# EasyEDA Pro project ProPrj_Y车Y形板_2025-09-30.epro, schematic DCDC
Board Name: TPS54540DCDC插座; Create Date: 2025-05-23; Page Name: P1; Project Name: Y车Y形板; Schematic Name: Schematic1; Update Date: 2025-05-23; Company: 嘉立创EDA; Page Size: A4; Version: V1.0
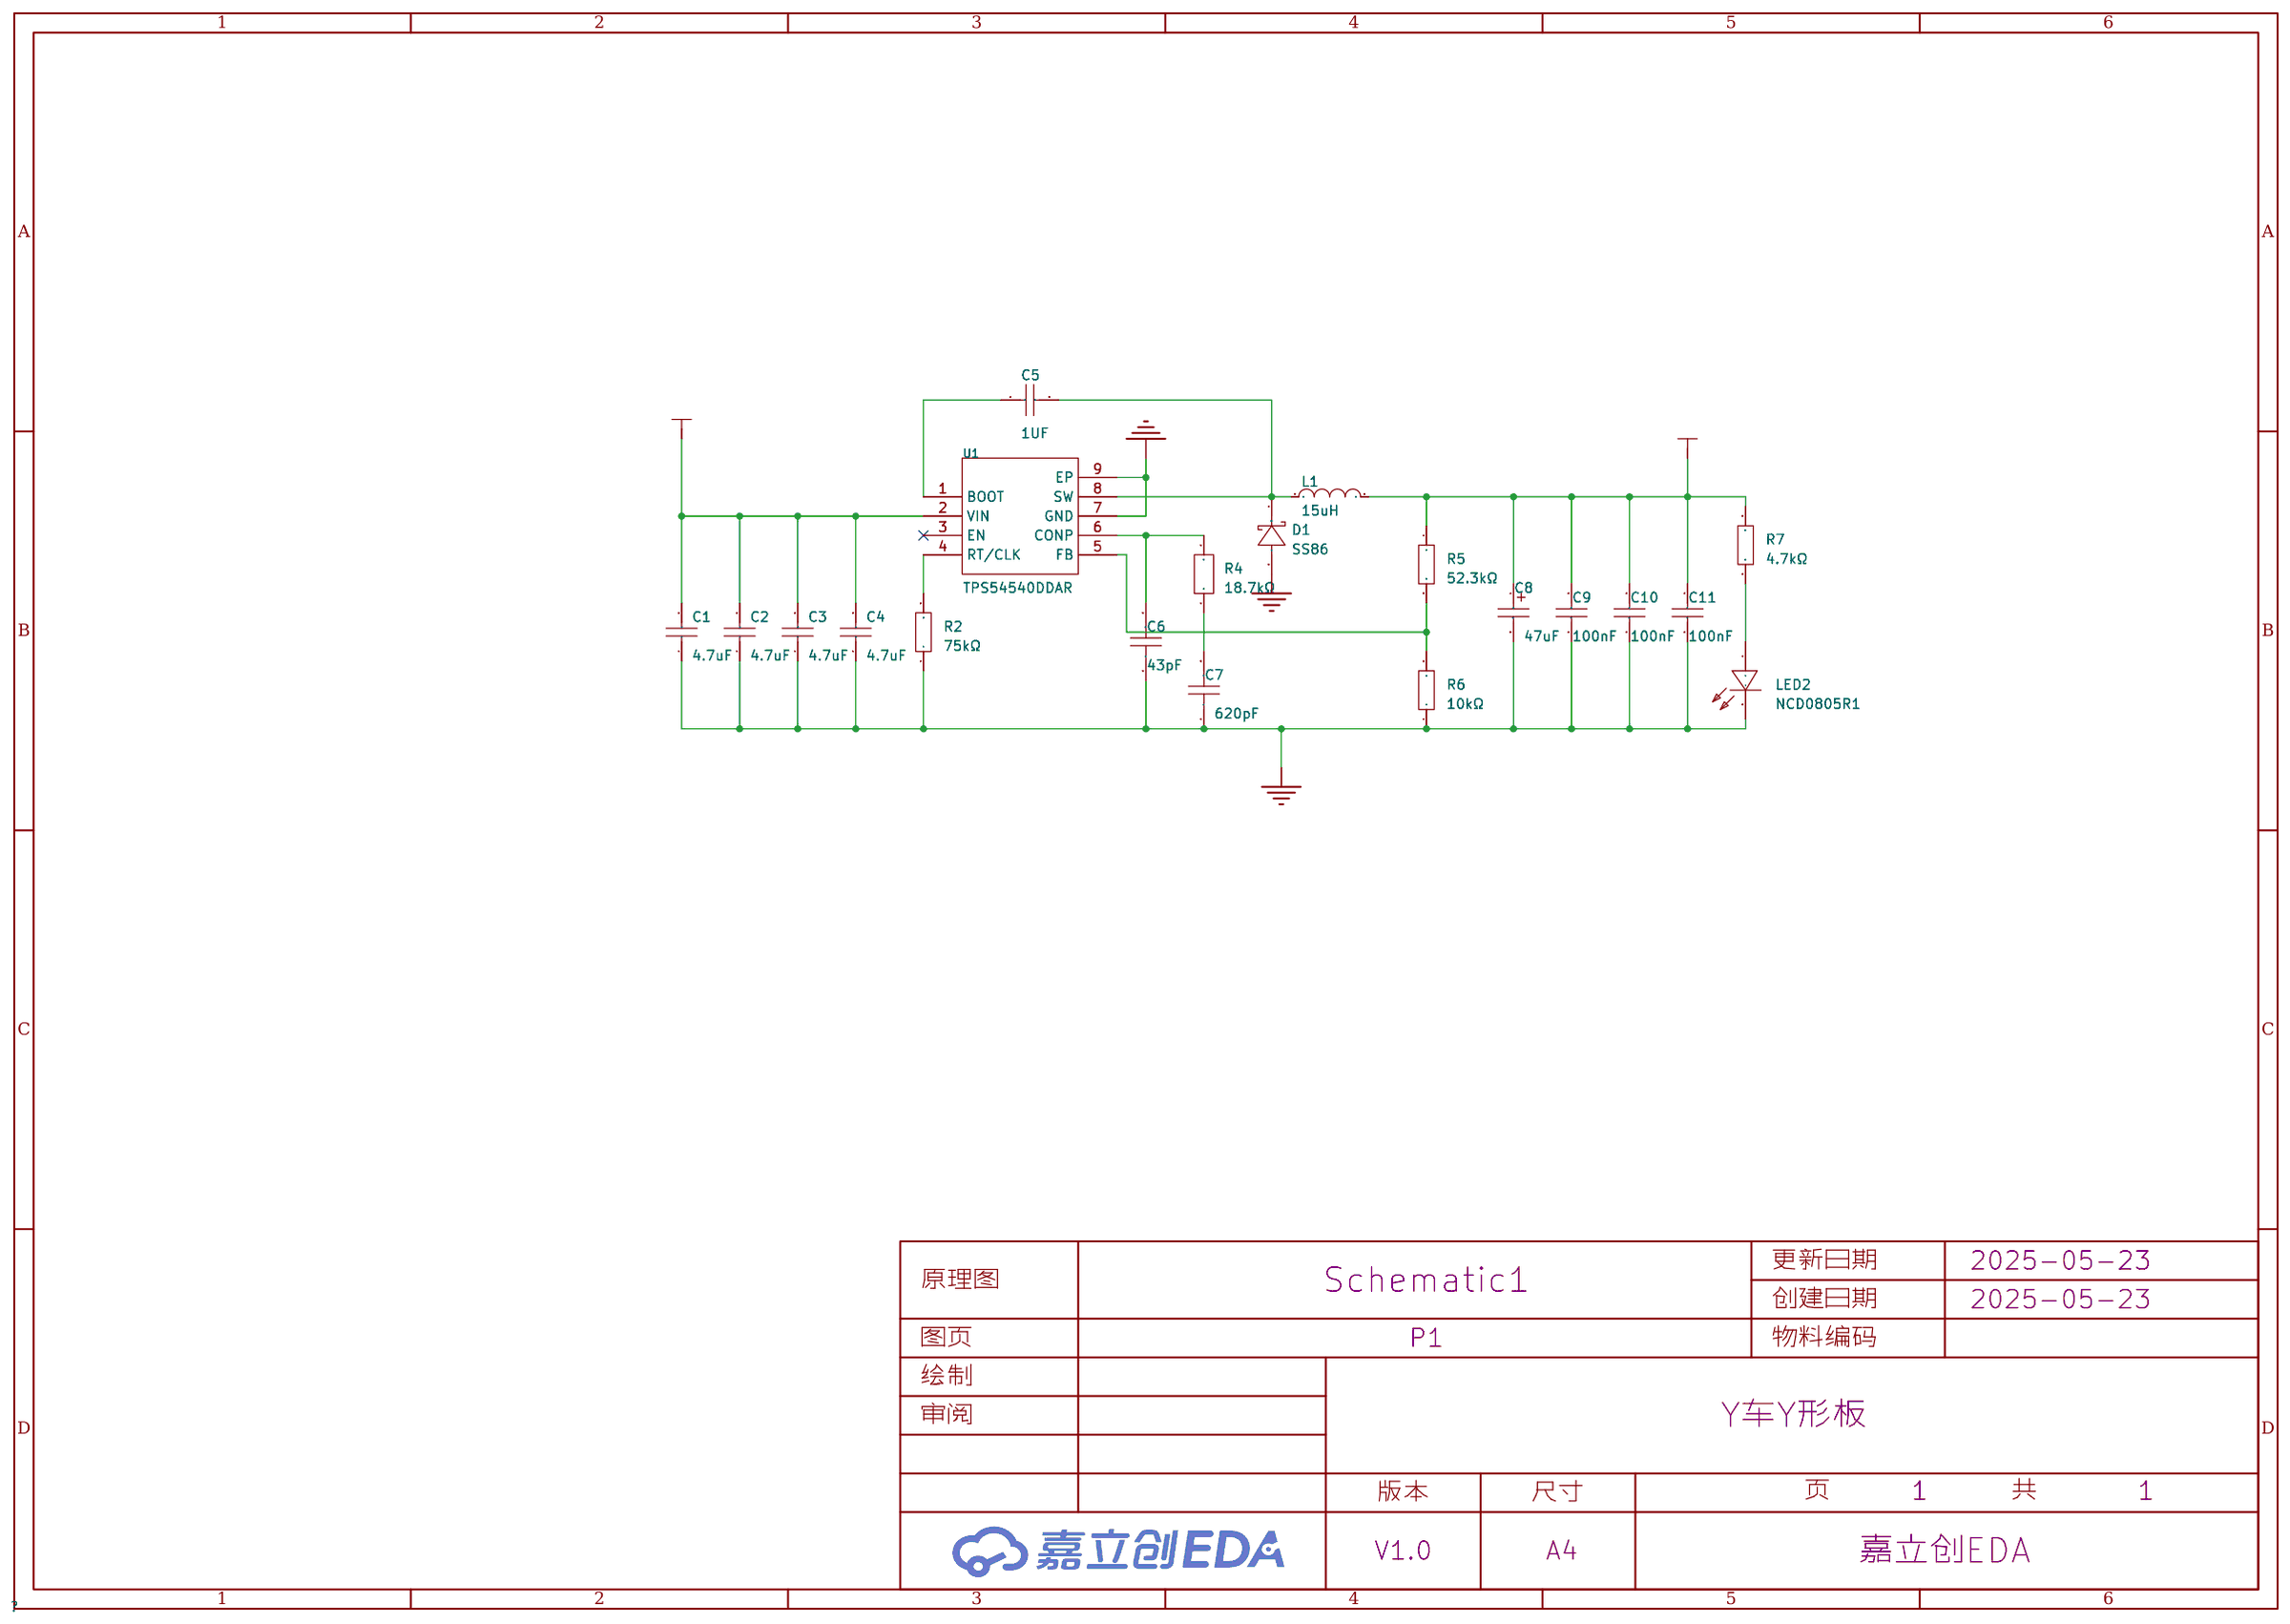
[diagram p1: schematic sheet]

## Parts
C1  4.7uF  [C0805]
C2  4.7uF  [C0805]
C3  4.7uF  [C0805]
C4  4.7uF  [C0805]
C5  1UF  [C0805]
C6  43pF  [C0805]
C7  620pF  [C0805]
C8  47uF  [CAP-SMD_L3.5-W2.8-R-RD]
C9  100nF  [C0805]
C10  100nF  [C0805]
C11  100nF  [C0805]
D1  SS86  [SMC_L6.9-W5.9-LS7.9-RD]
L1  15uH  [IND-SMD_L7.1-W6.6]
LED2  NCD0805R1  [LED0805-R-RD]
R2  75kΩ  [R0805]
R4  18.7kΩ  [R0805]
R5  52.3kΩ  [R0805]
R6  10kΩ  [R0805]
R7  4.7kΩ  [R0805]
U1  TPS54540DDAR  [SOIC-8_L4.9-W3.9-P1.27-LS6.0-BL-EP]

## Library data of the parts
C1-C4 = CL21A475KAQNNNE: 容值:4.7uF;精度:±10%;额定电压:25V;材质(温度系数):X5R;; LCSC Part Name: 4.7uF ±10% 25V; Supplier Part: C1779; Manufacturer: SAMSUNG(三星); Supplier Footprint: 0805; JLCPCB Part Class: 基础库; Datasheet: https://atta.szlcsc.com/upload/public/pdf/source/20160218/1457707763339.pdf; Supplier: LCSC; Tolerance: ±10%; Voltage Rated: 25V; Temperature Coefficient: X5R
C5 = CC0805KRX7R9BB104: 容值:100nF;精度:±10%;额定电压:50V;材质(温度系数):X7R;; LCSC Part Name: 100nF ±10% 50V; Supplier Part: C49678; Manufacturer: YAGEO(国巨); Supplier Footprint: 0805; JLCPCB Part Class: 基础库; Datasheet: https://atta.szlcsc.com/upload/public/pdf/source/20180224/C181747_15194369449651363981.pdf; Supplier: LCSC; Tolerance: ±10%; Voltage Rated: 50V; Temperature Coefficient: X7R
C6 = 0805CG430J500NT: 容值:43pF;精度:±5%;额定电压:50V;材质(温度系数):C0G;; LCSC Part Name: 43pF ±5% 50V; Supplier Part: C502147; Manufacturer: FH(风华); Supplier Footprint: 0805; JLCPCB Part Class: 扩展库; Datasheet: https://atta.szlcsc.com/upload/public/pdf/source/20200305/C486355_26A10D38EF8C2A5C37091D0039909270.pdf; Supplier: LCSC; Tolerance: ±5%; Voltage Rated: 50V; Temperature Coefficient: C0G
C7 = CC0805FRNPO9BN621: 容值:620pF;精度:±1%;额定电压:50V;材质(温度系数):NP0;; LCSC Part Name: 620pF ±1% 50V; Supplier Part: C541568; Manufacturer: YAGEO(国巨); Supplier Footprint: 0805; JLCPCB Part Class: 扩展库; Datasheet: https://atta.szlcsc.com/upload/public/pdf/source/20200615/C541568_5E136F40411BB8460285BCFF982D8614.pdf; Supplier: LCSC; Tolerance: ±1%; Voltage Rated: 50V; Temperature Coefficient: NP0
C8 = CA45-B010K476T: 容值:47uF;精度:±10%;额定电压:10V;等效串联电阻:1Ω@100kHz;; LCSC Part Name: 47uF ±10% 10V; Supplier Part: C123253; Manufacturer: 湘怡中元/湘江; Supplier Footprint: CASE-B-3528; JLCPCB Part Class: 扩展库; Datasheet: https://atta.szlcsc.com/upload/public/pdf/source/20181017/C123253_E44F021CD80332E438026884F943F9F2.pdf; Supplier: LCSC; Tolerance: ±10%; Rated Voltage: 10V; Equivalent Series Resistance(ESR): 1Ω@100kHz; Operating Temperature: -55℃~+125℃
C9-C11 = 0805B104K500NT: 容值:100nF;精度:±10%;额定电压:50V;材质(温度系数):X7R;; LCSC Part Name: 100nF ±10% 50V; Supplier Part: C38141; Manufacturer: FH(风华); Supplier Footprint: 0805; JLCPCB Part Class: 扩展库; Datasheet: https://atta.szlcsc.com/upload/public/pdf/source/20200305/C486355_26A10D38EF8C2A5C37091D0039909270.pdf; Supplier: LCSC; Tolerance: ±10%; Voltage Rated: 50V; Temperature Coefficient: X7R
D1 = SS86: 二极管配置:独立式;正向压降(Vf):700mV@8A;直流反向耐压(Vr):60V;平均整流电流(Io):8A;; LCSC Part Name: 电压:60V 电流:8A; Supplier Part: C698827; Manufacturer: YANGJIE(扬杰); Supplier Footprint: SMC(DO-214AB); JLCPCB Part Class: 扩展库; Datasheet: https://atta.szlcsc.com/upload/public/pdf/source/20200709/C698826_5E937841B5131ACF209993117D465D40.pdf; Supplier: LCSC; Diode Configuration: 独立式; Forward Voltage (Vf@If): 700mV@8A; Reverse Voltage (Vr): 60V; Average Rectified Current (Io): 8A; Reverse Leakage Current (Ir): 200uA@60V
L1 = PSPMAQ0605H-150M-ANP: 电感值:15uH;精度:±20%;额定电流:3.5A;饱和电流(Isat):6A;; LCSC Part Name: 15uH ±20% 6A; Supplier Part: C726343; Manufacturer: PROD(谱罗德); Supplier Footprint: SMD,6.6x7.1mm; JLCPCB Part Class: 扩展库; Datasheet: https://atta.szlcsc.com/upload/public/pdf/source/20200923/C726334_6740F679044ED6FAED7178765ABA7BEE.pdf; Supplier: LCSC; Tolerance: ±20%; Rated Current: 3.5A; Saturation Current (Isat): 6A; DC Resistance (DCR): 87mΩ; Ratings: AEC-Q200
LED2 = NCD0805R1: 灯头类型:-;发光颜色:红色;正向电压(VF):1.6V~2.6V;功率:65mW;正向电流:20mA;主波长:615nm~630nm;二极管配置:独立二极管;透镜颜色:无色透明;色温:-;发光强度:67mcd~195mcd;发光角度:130°;载带方式:-;工作温度:-30℃~+85℃;; Supplier Part: C84256; Manufacturer: 国星光电; Supplier Footprint: 0805; JLCPCB Part Class: 基础库; Datasheet: https://atta.szlcsc.com/upload/public/pdf/source/20200820/C84256_F0A75A43B3EAD75808600A0514C76B99.pdf; Supplier: LCSC; Emitted Color: 红色; Forward Voltage (VF): 1.6V~2.6V; Power Dissipation: 65mW; Forward Current: 20mA; Dominant Wavelength: 615nm~630nm; Diode Configuration: 独立二极管; Lens Color: 无色透明; Luminous Intensity: 67mcd~195mcd; Viewing Angle: 130°; Operating Temperature: -30℃~+85℃
R2 = 0805W8F7502T5E: 电阻类型:厚膜电阻;阻值:75kΩ;精度:±1%;功率:125mW;最大工作电压:150V;温度系数:±100ppm/℃;; LCSC Part Name: 75kΩ ±1% 125mW 厚膜电阻; Supplier Part: C17819; Manufacturer: UNI-ROYAL(厚声); Supplier Footprint: 0805; JLCPCB Part Class: 扩展库; Datasheet: https://atta.szlcsc.com/upload/public/pdf/source/20200306/C422600_1E6D84923E4A46A82E41ADD87F860B5C.pdf; Supplier: LCSC; Type: 厚膜电阻; Tolerance: ±1%; Power(Watts): 125mW; Overload Voltage (Max): 150V; Temperature Coefficient: ±100ppm/℃; Operating Temperature Range: -55℃~+155℃
R4 = RC0805FR-0718K7L: 电阻类型:厚膜电阻;阻值:18.7kΩ;精度:±1%;功率:125mW;最大工作电压:150V;温度系数:±100ppm/℃;; LCSC Part Name: 厚膜电阻 18.7kΩ ±1% 125mW; Supplier Part: C273880; Manufacturer: YAGEO(国巨); Supplier Footprint: 0805; JLCPCB Part Class: 扩展库; Datasheet: https://atta.szlcsc.com/upload/public/pdf/source/20191125/C364360_EA870FADD46A2AD4DBE56DD50D360B3E.pdf; Supplier: LCSC; Type: 厚膜电阻; Tolerance: ±1%; Power(Watts): 125mW; Overload Voltage (Max): 150V; Temperature Coefficient: ±100ppm/℃; Operating Temperature Range: -55℃~+155℃
R5 = RS-05K5232FT: 电阻类型:厚膜电阻;阻值:52.3kΩ;精度:±1%;功率:125mW;最大工作电压:150V;温度系数:±100ppm/℃;; LCSC Part Name: 厚膜电阻 52.3kΩ ±1% 125mW; Supplier Part: C322506; Manufacturer: FH(风华); Supplier Footprint: 0805; JLCPCB Part Class: 扩展库; Datasheet: https://atta.szlcsc.com/upload/public/pdf/source/20140616/1457707091974.pdf; Supplier: LCSC; Type: 厚膜电阻; Tolerance: ±1%; Power(Watts): 125mW; Overload Voltage (Max): 150V; Temperature Coefficient: ±100ppm/℃; Operating Temperature Range: -55℃~+155℃
R6 = 0805W8F1002T5E_C17414: 阻值:10kΩ;精度:±1%;功率:125mW;温度系数:±100ppm/℃;电阻类型:厚膜电阻;; LCSC Part Name: 10kΩ ±1% 125mW 厚膜电阻; Supplier Part: C17414; Manufacturer: UNI-ROYAL(厚声); Manufacturer Part: 0805W8F1002T5E; Supplier Footprint: 0805; JLCPCB Part Class: 基础库; Datasheet: https://atta.szlcsc.com/upload/public/pdf/source/20200306/C422600_1E6D84923E4A46A82E41ADD87F860B5C.pdf; Supplier: LCSC; Tolerance: ±1%; Power(Watts): 125mW; Overload Voltage (Max): 150V; Temperature Coefficient: ±100ppm/℃; Type: 厚膜电阻; Operating Temperature Range: -55℃~+155℃
R7 = 0805W8F1001T5E: 阻值:1kΩ;精度:±1%;功率:125mW;温度系数:±100ppm/℃;电阻类型:厚膜电阻;; LCSC Part Name: 1kΩ ±1% 125mW 厚膜电阻; Supplier Part: C17513; Manufacturer: UNI-ROYAL(厚声); Supplier Footprint: 0805; JLCPCB Part Class: 基础库; Datasheet: https://atta.szlcsc.com/upload/public/pdf/source/20200306/C422600_1E6D84923E4A46A82E41ADD87F860B5C.pdf; Supplier: LCSC; Tolerance: ±1%; Power(Watts): 125mW; Overload Voltage (Max): 150V; Temperature Coefficient: ±100ppm/℃; Type: 厚膜电阻; Operating Temperature Range: -55℃~+155℃
U1 = TPS54540DDAR: 功能类型:降压型;输出类型:可调;输入电压:4.5V~42V;输出电压:800mV~41.1V;输出电流(最大值):5A;; Supplier Part: C95286; Manufacturer: TI(德州仪器); Supplier Footprint: SOP-8-EP; JLCPCB Part Class: 扩展库; Datasheet: https://www.ti.com/cn/lit/gpn/tps54540; Supplier: LCSC; Function: 降压型; Synchronous Rectification: 否; Output Type: 可调; Number of Outputs: 1; Topology: 降压式; Input Voltage: 4.5V~42V; Output Voltage: 800mV~41.1V; Output Current (Max): 5A; Switching Frequency: 2.5MHz; Operating Temperature: -40℃~+150℃@(TJ)

## Nets
GND: C1.1 C2.1 C3.1 C4.1 C6.1 C7.1 C8.2 C9.1 C10.1 C11.1 D1.2(A) LED2.2(-) R2.1 R6.1 U1.7(GND) U1.9(EP)
VCC5V: C8.1 C9.2 C10.2 C11.2 L1.2 R5.1 R7.2
VCCBAT: C1.2 C2.2 C3.2 C4.2 U1.2(VIN)
$1N887: R2.2 U1.4(RT/CLK)
$1N888: C5.1 U1.1(BOOT)
$1N889: C5.2 D1.1(C) L1.1 U1.8(SW)
$1N890: C6.2 R4.2 U1.6(CONP)
$1N891: C7.2 R4.1
$1N892: R5.2 R6.2 U1.5(FB)
$1N987: LED2.1(+) R7.1

Not connected (* = marked no-connect by the designer): U1 3(EN)*
